# Altium schematic sheet hw_ESP8266_RFID_WinformC#_DiemDanhSV.SchDoc
size A; SheetNumber: 1; SheetTotal: 1
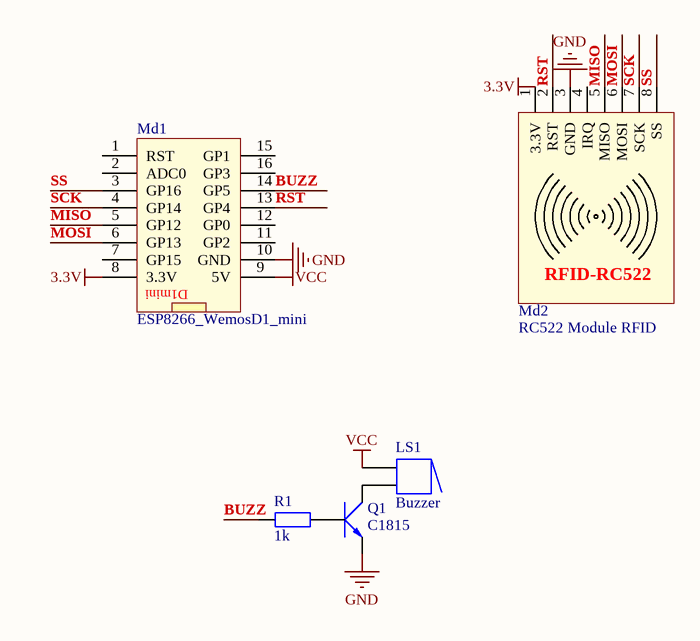
[diagram p0: hw_ESP8266_RFID_WinformC#_DiemDanhSV.SchDoc]

## Parts
LS1  Buzzer  [Buzzer]
Md1  ESP8266_WemosD1_mini  [ESP8266 WemosD1 mini]
Md2  RC522 Module RFID  [RC522_Module]
Q1  C1815  [QTO-92]
R1  1k  [R1/4W]

## Nets
3.3V: Md1.8(3.3V) Md2.1(3.3V)
GND: Md1.10(GND) Md2.3(GND) Q1.1(E)
VCC: LS1.1 Md1.9(5V)
BUZZ: Md1.14(GP5) R1.1
MISO: Md1.5(GP12) Md2.5(MISO)
MOSI: Md1.6(GP13) Md2.6(MOSI)
RST: Md1.13(GP4) Md2.2(RST)
SCK: Md1.4(GP14) Md2.7(SCK)
SS: Md1.3(GP16) Md2.8(SS)
NetLS1_2: LS1.2 Q1.2(C)
NetQ1_3: Q1.3(B) R1.2

Not connected (* = marked no-connect by the designer): Md1 1(RST) 2(ADC0) 7(GP15) 11(GP2) 12(GP0) 15(GP1) 16(GP3); Md2 4(IRQ)

## Notes on the sheet
- (in symbol ESP8266_WemosD1_mini) D1mini
- (in symbol RFID_RC522_Module) RFID-RC522

## Library data of the parts
LS1 = Buzzer: Magnetic Transducer Buzzer; Published: 24-Mar-1999; LatestRevisionDate: 17-Dec-2003; LatestRevisionNote: Schematic revised, PCB Footprint replaced.; DatasheetDocument: 17-Dec-2003; PackageReference: ABSM-1574; Publisher: Altium Limited; ComponentLink1Description: Manufacturer Link; ComponentLink1URL: http://www.megastar.com/linecard/buzzmode/index.php
Md2 = RFID_RC522_Module
Q1 = C1815_1: NPN 600mW, ECB; Value: C1815
R1 = R1/4W: Resistor 1/4W; Value: R1/4W - 1K